# EAGLE design houz_dmxSlave (EAGLE 9.4.0)
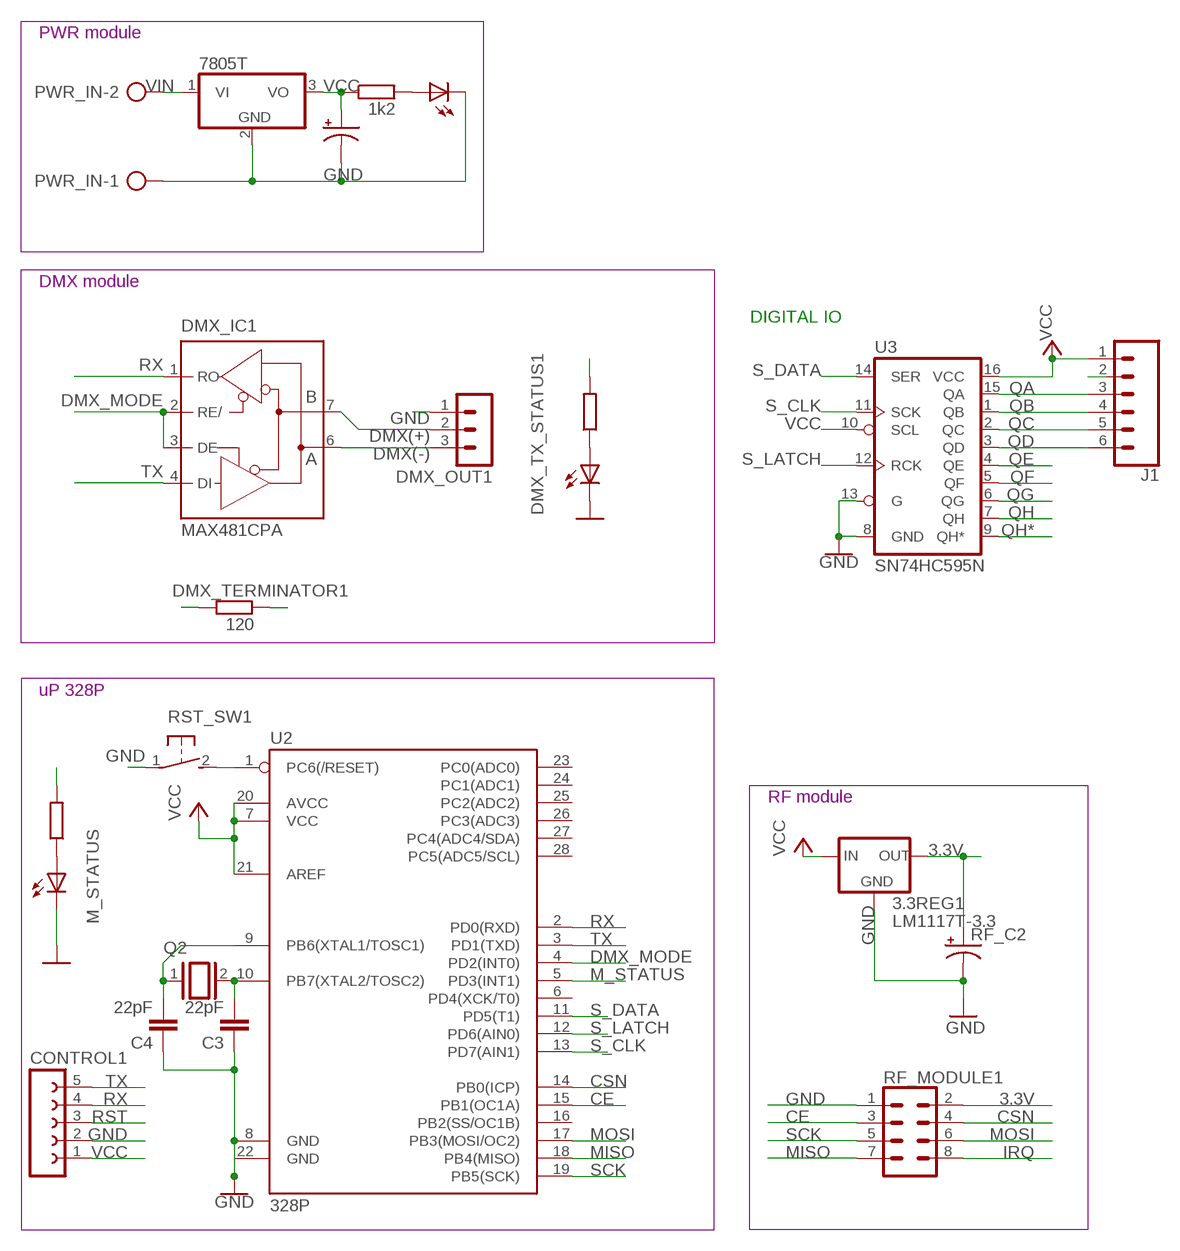
[diagram p0: schematic, sheet 1]

## Parts
3.3REG1  LM1117T-3.3  [TO220]
C3  22pF  C-EU050-030X075  [C050-030X075]
C4  22pF  C-EU050-030X075  [C050-030X075]
CONTROL1  FE05-1  [FE05-1]
DMX_IC1  MAX481CPA  [DIL08]
DMX_OUT1  MA03-1  [MA03-1]
DMX_R1  R-EU_0204/5  [0204/5]
DMX_TERMINATOR1  120  R-EU_0204/5  [0204/5]
DMX_TX_STATUS1  LED3MM  [LED3MM]
J1  CONN_06NO_SILK_FEMALE_PTH  [1X06_NO_SILK]
M_STATUS  LED3MM  [LED3MM]
M_STATUS_R1  R-EU_0207/10  [0207/10]
PWR_C1  CPOL-USE5-10.5  [E5-10,5]
PWR_IC1  7805T  [TO220H]
PWR_IN  AK500/2-H  [AK500/2-H]
PWR_L1  LED3MM  [LED3MM]
PWR_R1  1k2  R-EU_0204/5  [0204/5]
Q2  16MHz  XTAL/S  [QS]
RF_C2  CPOL-USE5-10.5  [E5-10,5]
RF_MODULE1  CONN_04X2  [2X4]
RST_SW1  DTS-3  [DTS-3]
U2  328P  ATMEGA328P_PDIP  [DIP28]
U3  SN74HC595N  74HC595N  [DIP16]

## Nets
3.3V: 3.3REG1.2(OUT) RF_C2.+ RF_MODULE1.2
CE: RF_MODULE1.3 U2.15(PB1(OC1A))
CSN: RF_MODULE1.4 U2.14(PB0(ICP))
DMX(+): DMX_IC1.7(B) DMX_OUT1.2 DMX_R1.2 DMX_TERMINATOR1.2
DMX(-): DMX_IC1.6(A) DMX_OUT1.3 DMX_TERMINATOR1.1
DMX_MODE: DMX_IC1.2(RE/) DMX_IC1.3(DE) U2.4(PD2(INT0))
DMX_TX_STATUS_LEF1: M_STATUS.A M_STATUS_R1.1
DMX_TX_STATUS_LEF2: DMX_R1.1 DMX_TX_STATUS1.A
GND: 3.3REG1.1(GND) C3.1 C4.1 CONTROL1.2 DMX_OUT1.1 DMX_TX_STATUS1.K(C) J1.2 M_STATUS.K(C) PWR_C1.- PWR_IC1.2(GND) PWR_IN.1 PWR_L1.K(C) RF_C2.- RF_MODULE1.1 RST_SW1.1 U2.8(GND) U2.22(GND) U3.8(GND) U3.13(G)
IRQ: RF_MODULE1.8
M_STATUS: M_STATUS_R1.2 U2.5(PD3(INT1))
MISO: RF_MODULE1.7 U2.18(PB4(MISO))
MOSI: RF_MODULE1.6 U2.17(PB3(MOSI/OC2))
N$1: PWR_L1.A PWR_R1.2
QA: J1.3 U3.15(QA)
QB: J1.4 U3.1(QB)
QC: J1.5 U3.2(QC)
QD: J1.6 U3.3(QD)
QE: U3.4(QE)
QF: U3.5(QF)
QG: U3.6(QG)
QH: U3.7(QH)
QH*: U3.9(QH*)
RST: CONTROL1.3 RST_SW1.2 U2.1(PC6(/RESET))
RX: CONTROL1.4 DMX_IC1.1(RO) U2.2(PD0(RXD))
S_CLK: U2.13(PD7(AIN1)) U3.11(SCK)
S_DATA: U2.11(PD5(T1)) U3.14(SER)
S_LATCH: U2.12(PD6(AIN0)) U3.12(RCK)
SCK: RF_MODULE1.5 U2.19(PB5(SCK))
TX: CONTROL1.5 DMX_IC1.4(DI) U2.3(PD1(TXD))
VCC: 3.3REG1.3(IN) CONTROL1.1 J1.1 PWR_C1.+ PWR_IC1.3(VO) PWR_R1.1 U2.7(VCC) U2.20(AVCC) U2.21(AREF) U3.10(SCL) U3.16(VCC)
VIN: PWR_IC1.1(VI) PWR_IN.2
X3: C4.2 Q2.1 U2.9(PB6(XTAL1/TOSC1))
X4: C3.2 Q2.2 U2.10(PB7(XTAL2/TOSC2))
Unconnected: U2.6(PD4(XCK/T0)) U2.16(PB2(SS/OC1B)) U2.23(PC0(ADC0)) U2.24(PC1(ADC1)) U2.25(PC2(ADC2)) U2.26(PC3(ADC3)) U2.27(PC4(ADC4/SDA)) U2.28(PC5(ADC5/SCL))

## Notes on the sheet
- PWR module
- DMX module
- DIGITAL IO
- uP 328P
- RF module

## Power pins joined to a net without a drawn wire
GND: DMX_IC1.5(GND)
VCC: DMX_IC1.8(VCC)

## Library data of the parts
3.3REG1 = lm1117:LM1117T-*
C3 C4 = rcl:C-EU: CAPACITOR, European symbol; SPICEPREFIX: C
CONTROL1 = con-lsta:FE05-1: FEMALE HEADER; OC_FARNELL: unknown; OC_NEWARK: unknown
DMX_IC1 = maxim:MAX481CPA: RS485 TRANSEIVER; MPN: MAX481CPA+; OC_FARNELL: unknown; OC_NEWARK: 99K3445
DMX_OUT1 = con-lstb:MA03-1: PIN HEADER; OC_FARNELL: unknown; OC_NEWARK: unknown
DMX_R1 DMX_TERMINATOR1 M_STATUS_R1 PWR_R1 = resistor:R-EU_: RESISTOR, European symbol
DMX_TX_STATUS1 M_STATUS PWR_L1 = adafruit:LED: LED OSRAM: - CHIPLED LG R971, LG N971, LY N971, LG Q971, LY Q971, LO R971, LY R971 LH N974, LH R974 LS Q976, LO Q976, LY Q976 LO Q996 - Hyper CHIPLED LW Q18S LB Q993, LB Q99A, LB R99A - SideLED LS A670, LO A670, LY A670, LG A670, LP A670 LB A673, LV A673, LT A673, LW A673 LH A674 LY A675 LS A676, LA A676, LO A676, LY A676, LW A676 LS A679, LY A679, LG A679 - Hyper Micro SIDELED® LS Y876, LA Y876, LO Y876, LY Y876 LT Y87S - SmartLED LW L88C, LW L88S LB L89C, LB L89S, LG L890 LS L89K, LO L89K, LY L89K LS L896, LA L896, LO L896, LY L896 - TOPLED LS T670, LO T670, LY T670, LG T670, LP T670 LSG T670, LSP T670, LSY T670, LOP T670, LYG T670 LG T671, LOG T671, LSG T671 LB T673, LV T673, LT T673, LW T673 LH T674 LS T676, LA T676, LO T676, LY T676, LB T676, LH T676, LSB T676, LW T676 LB T67C, LV T67C, LT T67C, LS T67K, LO T67K, LY T67K, LW E67C LS E67B, LA E67B, LO E67B, LY E67B, LB E67C, LV E67C, LT E67C LW T67C LS T679, LY T679, LG T679 LS T770, LO T770, LY T770, LG T770, LP T770 LB T773, LV T773, LT T773, LW T773 LH T774 LS E675, LA E675, LY E675, LS T675 LS T776, LA T776, LO T776, LY T776, LB T776 LHGB T686 LT T68C, LB T68C - Hyper Mini TOPLED® LB M676 - Mini TOPLED Santana® LG M470 LS M47K, LO M47K, LY M47K Source: http://www.osram.convergy.de/
J1 = SparkFun-Connectors:CONN_06: Multi connection point. Often used as Generic Header-pin footprint for 0.1 inch spaced/style header connections On any of the 0.1 inch spaced packages, you can populate with these: Break Away Headers - Straight <https://www.sparkfun.com/products/116> (PRT-00116) Break Away Male Headers - Right Angle <https://www.sparkfun.com/products/553> (PRT-00553) Female Headers <https://www.sparkfun.com/products/115> (PRT-00115) Break Away Headers - Machine Pin <https://www.sparkfun.com/products/117> (PRT-00117) Break Away Female Headers - Swiss Machine Pin <https://www.sparkfun.com/products/743> (PRT-00743) Arduino Stackable Header - 6 Pin <https://www.sparkfun.com/products/9280> (PRT-09280) For SCREWTERMINALS and SPRING TERMINALS visit here: Screw Terimnals on SparkFun.com <https://www.sparkfun.com/search/results?term=Screw+Terminals> (5mm/3.5mm/2.54mm spacing) This device is also useful as a general connection point to wire up your design to another part of your project. Our various solder wires solder well into these plated through hole pads. Hook-Up Wire - Assortment (Stranded, 22 AWG) <https://www.sparkfun.com/products/11375> (PRT-11375) Hook-Up Wire - Assortment (Solid Core, 22 AWG) <https://www.sparkfun.com/products/11367> (PRT-11367) View the entire wire category on our website here <https://www.sparkfun.com/categories/141>; PROD_ID: CONN-08437
PWR_C1 RF_C2 = adafruit:CPOL-US: POLARIZED CAPACITOR, American symbol
PWR_IC1 = linear:78*: Positive VOLTAGE REGULATOR Source: http://cache.national.com/ds/LM/LM78L05.pdf http://www.fairchildsemi.com/ds/LM/LM7805.pdf
PWR_IN = con-ptr500:AK500/2-H: CONNECTOR Aug. 2004 / PTR Meßtechnik: Die Bezeichnung der Serie AK505 wurde geändert. Es handelt sich hierbei um AK500 in horizontaler Ausführung.; OC_FARNELL: unknown; OC_NEWARK: unknown
Q2 = special:XTAL/S: CRYSTAL
RF_MODULE1 = SparkFun-Connectors:CONN_04X2: Multi connection point. Often used as Generic Header-pin footprint for 0.1 inch spaced/style header connections On any of the 0.1 inch spaced packages, you can populate with these: Break Away Headers - Straight <https://www.sparkfun.com/products/116> (PRT-00116) Break Away Male Headers - Right Angle <https://www.sparkfun.com/products/553> (PRT-00553) Female Headers <https://www.sparkfun.com/products/115> (PRT-00115) Break Away Headers - Machine Pin <https://www.sparkfun.com/products/117> (PRT-00117) Break Away Female Headers - Swiss Machine Pin <https://www.sparkfun.com/products/743> (PRT-00743)
RST_SW1 = switch-tact:DTS-3
U2 = SparkFun-IC-Microcontroller:ATMEGA328P_PDIP: Atmel 328P Through hole ATMEGA328P uC used in the Arduino 32kb flash, 1k EEPROM, 2k SRAM Datasheet <http://www.sparkfun.com/datasheets/Components/SMD/ATMega328.pdf> SparkFun Products Storefront component: AVR 28 Pin 20MHz 32K 6A/D - ATMega328P <https://www.sparkfun.com/products/9061> (COM-09061) SparkFun Simon Says - Through-Hole Soldering Kit <https://www.sparkfun.com/products/10547> (KIT-10547) SparkFun Learn to Solder - Simon Says <https://www.sparkfun.com/products/13708> (KIT-13708) SparkFun BigTime Watch Kit <https://www.sparkfun.com/products/11734> (KIT-11734) SparkFun ClockIt <https://www.sparkfun.com/products/10930> (KIT-10930) SparkFun Serial Enabled LCD Kit <https://www.sparkfun.com/products/10097> (LCD-10097) SparkFun Simon Tilts - Through Hole Soldering Kit <https://www.sparkfun.com/products/12634> (KIT-12634) SparkFun Frequency Counter Kit <https://www.sparkfun.com/products/10140> (KIT-10140) FabFM Radio Kit <https://www.sparkfun.com/products/11043> (KIT-11043) SparkFun Binary Blaster Kit <https://www.sparkfun.com/products/12037> (KIT-12037) SparkFun Metro-Gnome <https://www.sparkfun.com/products/9236> (KIT-09236) ATmega328 with Arduino Optiboot (Uno) <https://www.sparkfun.com/products/10524> (DEV-10524); PROD_ID: IC-09136
U3 = SparkFun-IC-Logic:74*595: 8-Bit Shift Register (Serial to Parallel) Datasheet <http://cdn.sparkfun.com/datasheets/BreakoutBoards/MM74HC595.pdf> SparkFun Products SparkFun Shift Register Breakout - 74HC595 <https://www.sparkfun.com/products/10680> (BOB-10680); PROD_ID: IC-13123

## Net classes
0 default: clearance 0.205 mm

## Board
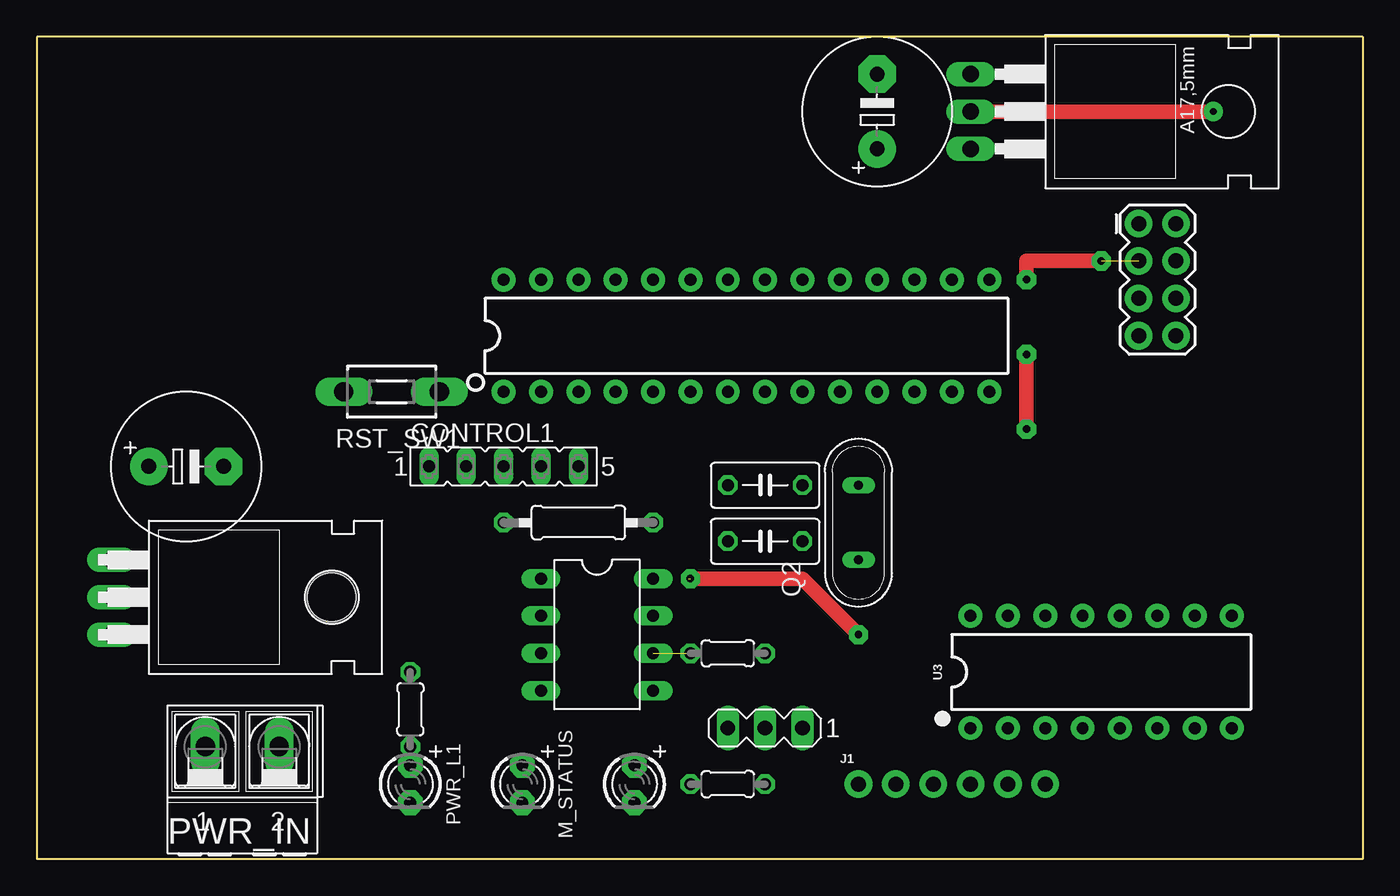
[diagram p1: board, top side]
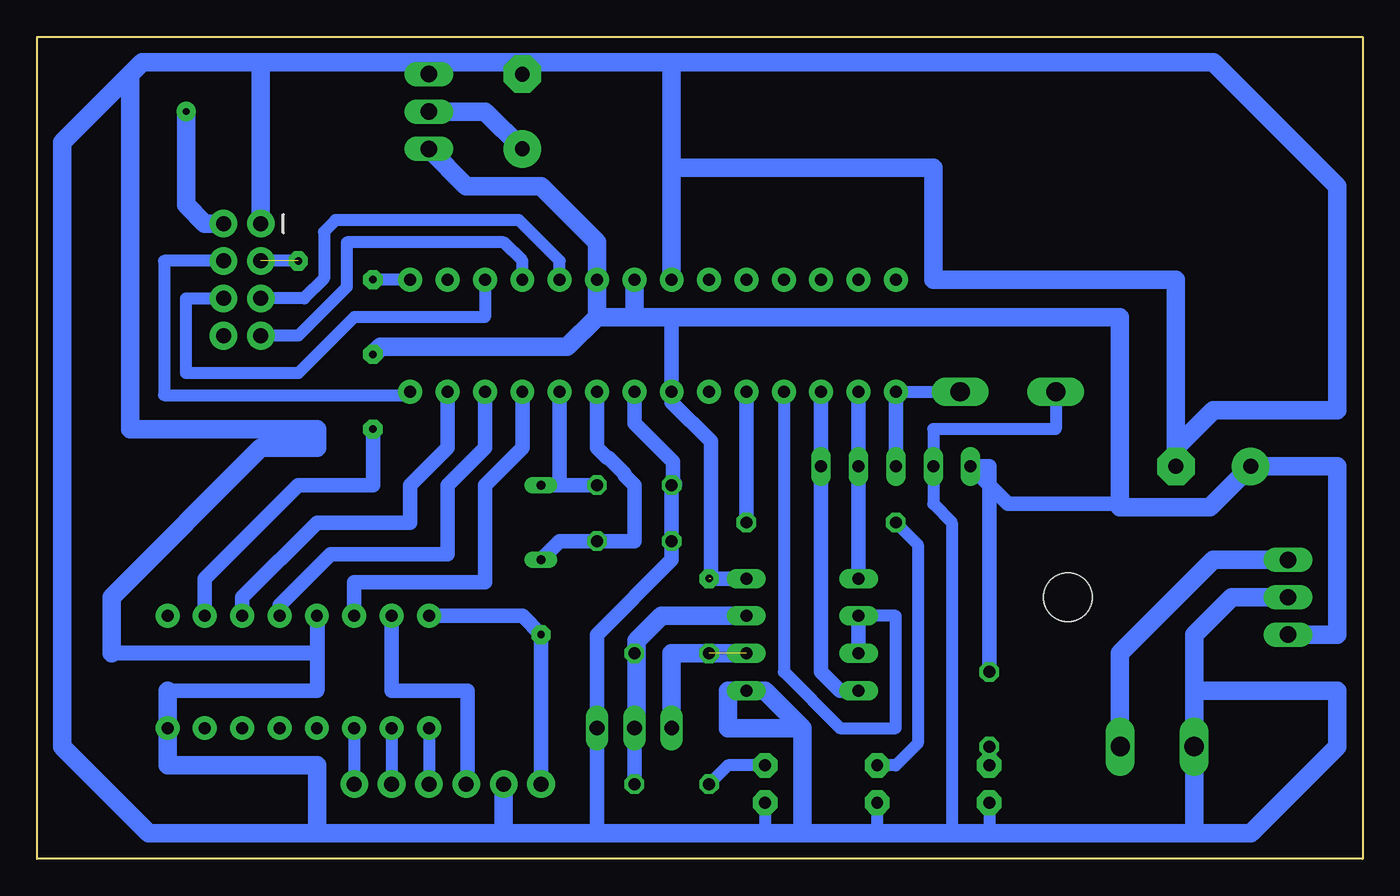
[diagram p2: board, bottom side, seen from below]

Size 90.17 x 55.88 mm. Coordinates in mm from the lower left corner, seen from the top.
Outline: 90.17,55.88 90.17,0 0,0 0,55.88 90.17,55.88
Copper layers (1*16): Top 0.035mm / dielectric 1.5mm / Bottom 0.035mm
Design rules "default *": minimum track width 6mil, minimum drill 0.35mm, track to track 0.7mm, track to pad 0.7mm, pad to pad 6mil, via to via 6mil, smd to smd 6mil, copper to edge 40mil, drill to drill 6mil, minimum pad ring 10mil, minimum via ring 8mil, stop-mask expansion 4mil, vias tented up to drill 0mil, thermal gap 10mil

### Footprints (pad centres in the part's own frame; a part is rotated, then mirrored left to right if it is on the bottom)
TO220 = drill 1.118 long: 1 -2.54,-6.35; 2 0,-6.35; 3 2.54,-6.35
C050-030X075 = drill 0.813 octagon: 1 -2.54,0; 2 2.54,0
FE05-1 = drill 0.813 long: 1 -5.08,0; 2 -2.54,0; 3 0,0; 4 2.54,0; 5 5.08,0
DIL08 = drill 0.813 long: 1 -3.81,-3.81; 2 -1.27,-3.81; 3 1.27,-3.81; 4 3.81,-3.81; 5 3.81,3.81; 6 1.27,3.81; 7 -1.27,3.81; 8 -3.81,3.81
MA03-1 = drill 1.016 long: 1 -2.54,0; 2 0,0; 3 2.54,0
0204/5 = drill 0.813 octagon: 1 -2.54,0; 2 2.54,0
LED3MM = drill 0.813 pad 1.676 octagon: A -1.27,0; K 1.27,0
1X06_NO_SILK = drill 1.016 pad 1.88: 1 0,0; 2 2.54,0; 3 5.08,0; 4 7.62,0; 5 10.16,0; 6 12.7,0
0207/10 = drill 0.813 octagon: 1 -5.08,0; 2 5.08,0
E5-10,5 = drill 1.016 pad 2.54: + -2.54,0 | drill 1.016 pad 2.54 octagon: - 2.54,0
TO220H = drill 1.118 long: 1 -2.54,-10.16; 2 0,-10.16; 3 2.54,-10.16 | hole 3.302: 0,4.826
AK500/2-H = drill 1.321 long: 1 -2.515,0; 2 2.515,0
QS = drill 0.61 long: 1 -2.54,0; 2 2.54,0
2X4 = drill 1.016 pad 1.88: 1 -3.81,-1.27; 2 -3.81,1.27; 3 -1.27,-1.27; 4 -1.27,1.27; 5 1.27,-1.27; 6 1.27,1.27; 7 3.81,-1.27; 8 3.81,1.27
DTS-3 = drill 1.3 long: 1 -3.25,0; 2 3.25,0
DIP28 = drill 0.813 pad 1.626: 1 -16.51,-3.81; 2 -13.97,-3.81; 3 -11.43,-3.81; 4 -8.89,-3.81; 5 -6.35,-3.81; 6 -3.81,-3.81; 7 -1.27,-3.81; 8 1.27,-3.81; 9 3.81,-3.81; 10 6.35,-3.81; 11 8.89,-3.81; 12 11.43,-3.81; 13 13.97,-3.81; 14 16.51,-3.81; 15 16.51,3.81; 16 13.97,3.81; 17 11.43,3.81; 18 8.89,3.81; 19 6.35,3.81; 20 3.81,3.81; 21 1.27,3.81; 22 -1.27,3.81; 23 -3.81,3.81; 24 -6.35,3.81; 25 -8.89,3.81; 26 -11.43,3.81; 27 -13.97,3.81; 28 -16.51,3.81
DIP16 = drill 0.813 pad 1.626: 1 -8.89,-3.81; 2 -6.35,-3.81; 3 -3.81,-3.81; 4 -1.27,-3.81; 5 1.27,-3.81; 6 3.81,-3.81; 7 6.35,-3.81; 8 8.89,-3.81; 9 8.89,3.81; 10 6.35,3.81; 11 3.81,3.81; 12 1.27,3.81; 13 -1.27,3.81; 14 -3.81,3.81; 15 -6.35,3.81; 16 -8.89,3.81

### Placement (x,y rotation side)
3.3REG1  69.85,50.8 270 top
C3  49.53,25.4 0 top
C4  49.53,21.59 0 top
CONTROL1  31.75,26.67 0 top
DMX_IC1  38.1,15.24 270 top
DMX_OUT1  49.53,8.89 180 top
DMX_R1  46.99,5.08 0 top
DMX_TERMINATOR1  46.99,13.97 0 top
DMX_TX_STATUS1  40.64,5.08 270 top
J1  55.88,5.08 0 top
M_STATUS  33.02,5.08 270 top
M_STATUS_R1  36.83,22.86 0 top
PWR_C1  10.16,26.67 0 top
PWR_IC1  15.24,17.78 270 top
PWR_IN  13.97,7.62 0 top
PWR_L1  25.4,5.08 270 top
PWR_R1  25.4,10.16 270 top
Q2  55.88,22.86 90 top
RF_C2  57.15,50.8 90 top
RF_MODULE1  76.2,39.37 270 top
RST_SW1  24.13,31.75 0 top
U2  48.26,35.56 0 top
U3  72.39,12.7 0 top

### Tracks (layer width: path | path; a pad name or v marks a point on that pad's centre or on a via)
3.3V  (via drill 0.45 pad 1.3)
  Top 1: 3.3REG1.2 v80.01,50.8
  Bottom 1.27: v80.01,50.8 80.01,44.45 78.74,43.18 RF_MODULE1.2 | 3.3REG1.2 59.69,50.8 RF_C2.+
CE  (via drill 0.5 pad 1.3)  (2 unrouted)
  Top 1: v67.31,39.37 67.31,40.64 v72.39,40.64
  Bottom 0.8: U2.15 v67.31,39.37 | v72.39,40.64 RF_MODULE1.3
CSN
  Bottom 0.8: RF_MODULE1.4 81.51,40.64 81.51,31.52 65,31.52 U2.14
DMX(+)
  Bottom 1: DMX_TERMINATOR1.2 49.39,13.97 | DMX_OUT1.2 DMX_R1.2
  Bottom 1.27: DMX_OUT1.2 49.39,9.03 49.39,13.97 49.39,14.82 47.7,16.51 DMX_IC1.7
DMX(-)  (1 unrouted)
  Bottom 1.27: DMX_IC1.6 46.99,13.97 DMX_OUT1.3
DMX_MODE
  Bottom 0.8: U2.4 39.37,12.7 35.56,8.89 31.75,8.89 31.75,16.51 DMX_IC1.2
  Bottom 1: DMX_IC1.2 DMX_IC1.3
DMX_TX_STATUS_LEF1
  Bottom 0.8: M_STATUS.A 31.75,6.35 30.25,7.85 30.25,21.36 M_STATUS_R1.1
DMX_TX_STATUS_LEF2
  Bottom 0.813: DMX_TX_STATUS1.A 43.18,6.35 DMX_R1.1
GND
  Bottom 0.8: RST_SW1.1 20.88,29.21 29.21,29.21 CONTROL1.2 29.21,24.13 27.94,22.86 27.94,1.73 | 3.3REG1.1 62.43,54.15
  Bottom 0.813: PWR_L1.K 25.4,1.73 | M_STATUS.K 33.02,1.73 | DMX_TX_STATUS1.K 40.64,1.73
  Bottom 1: U2.8 49.53,29.62 46.92,27.01 46.92,25.47 | C3.1 C4.1 46.99,20.32 52.07,15.24 DMX_OUT1.1 52.07,1.73 | 71.12,11.43 81.28,11.43
  Bottom 1.016: U3.13 71.12,13.97 | 71.12,13.97 71.12,11.43 | 71.12,13.97 85.09,13.97
  Bottom 1.27: PWR_IC1.2 8.89,17.78 11.46,15.21 11.46,11.43 | 11.46,11.43 PWR_IN.1 11.46,1.73 | 11.46,1.73 25.4,1.73 27.94,1.73 33.02,1.73 38.1,1.73 | 38.1,1.73 40.64,1.73 52.07,1.73 58.42,1.73 | 58.42,1.73 71.12,1.73 | 71.12,1.73 82.55,1.73 88.44,7.62 88.44,48.72 83.82,53.34 | 83.82,53.34 83.01,54.15 74.93,54.15 | 74.93,54.15 63.5,54.15 | 63.5,54.15 62.43,54.15 57.15,54.15 | 57.15,54.15 46.99,54.15 | 46.99,54.15 10.16,54.15 1.73,45.72 1.73,30.48 10.16,30.48 12.7,27.94 PWR_C1.- 12.7,39.37 29.21,39.37 29.21,46.99 46.99,46.99 | C3.1 46.92,25.47 | 38.1,8.89 40.64,11.43 DMX_IC1.5 43.18,11.43 43.18,8.89 38.1,8.89 | 38.1,8.89 38.1,1.73 | J1.2 58.42,1.73 | U2.22 46.99,46.99 | 46.99,46.99 46.99,54.15 | 3.3REG1.1 63.5,54.15 | RF_MODULE1.1 74.93,54.15 | RF_C2.- 57.15,54.15 | 11.46,11.43 1.73,11.43 1.73,7.62 7.62,1.73 11.46,1.73 | 81.28,11.43 U3.8 81.28,6.35 71.12,6.35 71.12,1.73 | 83.82,53.34 83.82,29.21 71.12,29.21 71.12,27.94 74.93,27.94 85.09,17.78 85.09,13.97
M_STATUS
  Bottom 1: U2.5 M_STATUS_R1.2
MISO
  Bottom 0.8: U2.18 57.15,40.64 58.42,41.91 69.09,41.91 69.09,38.86 72.39,35.56 RF_MODULE1.7
MOSI
  Bottom 0.8: U2.17 59.69,36.83 68.58,36.83 72.39,33.02 80.01,33.02 80.01,38.1 RF_MODULE1.6
N$1
  Bottom 1: PWR_R1.2 PWR_L1.A
QA
  Bottom 1: U3.15 66.04,11.43 60.86,11.43 60.86,5.18 J1.3
QB
  Bottom 0.8: U3.1 J1.4
QC
  Bottom 0.8: U3.2 J1.5
QD
  Bottom 0.8: U3.3 J1.6
RST
  Bottom 0.8: U2.1 RST_SW1.2
  Bottom 1: U2.1 CONTROL1.3
RX
  Bottom 1: U2.2 CONTROL1.4 DMX_IC1.1
S_CLK
  Bottom 1: U2.13 62.23,27.94 64.77,25.4 64.77,22.86 71.12,22.86 76.2,17.78 U3.11
S_DATA
  Bottom 1: U3.14 68.58,18.8 59.69,18.8 59.69,25.4 57.15,27.94 U2.11
S_LATCH
  Bottom 1: U3.12 73.66,17.24 70.2,20.7 62.23,20.7 62.23,25.4 59.69,27.94 U2.12
SCK
  Bottom 0.8: U2.19 54.61,40.64 57.38,43.41 69.85,43.41 70.64,42.62 70.64,39.43 71.97,38.1 RF_MODULE1.5
TX
  Bottom 1: U2.3 CONTROL1.5 36.83,12.7 35.56,11.43 DMX_IC1.4
VCC  (via drill 0.5 pad 1.3)  (1 unrouted)
  Top 1: v44.45,19.05 52.07,19.05 v55.88,15.24 | v67.31,34.29 v67.31,29.21
  Bottom 1: DMX_IC1.8 44.32,19.05 44.32,28.37 46.99,31.04 U2.7 46.99,36.83 | 16.51,24.13 24.13,24.13 CONTROL1.1 25.4,26.67 PWR_R1.1 | J1.1 v55.88,15.24 57.15,16.51 U3.16 | v67.31,29.21 67.31,25.4 72.39,25.4 78.74,19.05 U3.10
  Bottom 1.27: PWR_IC1.3 1.73,15.24 1.73,26.67 PWR_C1.+ 10.39,23.9 16.51,23.9 16.51,24.13 16.51,36.83 46.99,36.83 49.53,36.83 | 52.07,36.83 49.53,36.83 | U2.21 49.53,36.83 | 52.07,36.83 U2.20 52.07,41.91 55.88,45.72 60.96,45.72 3.3REG1.3 | 52.07,36.83 54.1,34.8 66.8,34.8 v67.31,34.29
VIN
  Bottom 1.27: PWR_IC1.1 10.16,20.32 16.51,13.97 16.51,7.64 PWR_IN.2
X3
  Bottom 1: Q2.1 54.61,21.59 C4.2 49.53,21.59 49.53,25.4 50.21,26.08 50.21,26.17 51.3,27.26 51.39,27.26 52.07,27.94 U2.9
X4
  Bottom 1: C3.2 54.61,25.4 | 54.61,25.4 Q2.2 | U2.10 54.61,25.4

### Text on the board
_tNames: U2 | PWR_IN